# Altium schematic sheet USB.SchDoc
size A4; SheetNumber: 4; SheetTotal: 10
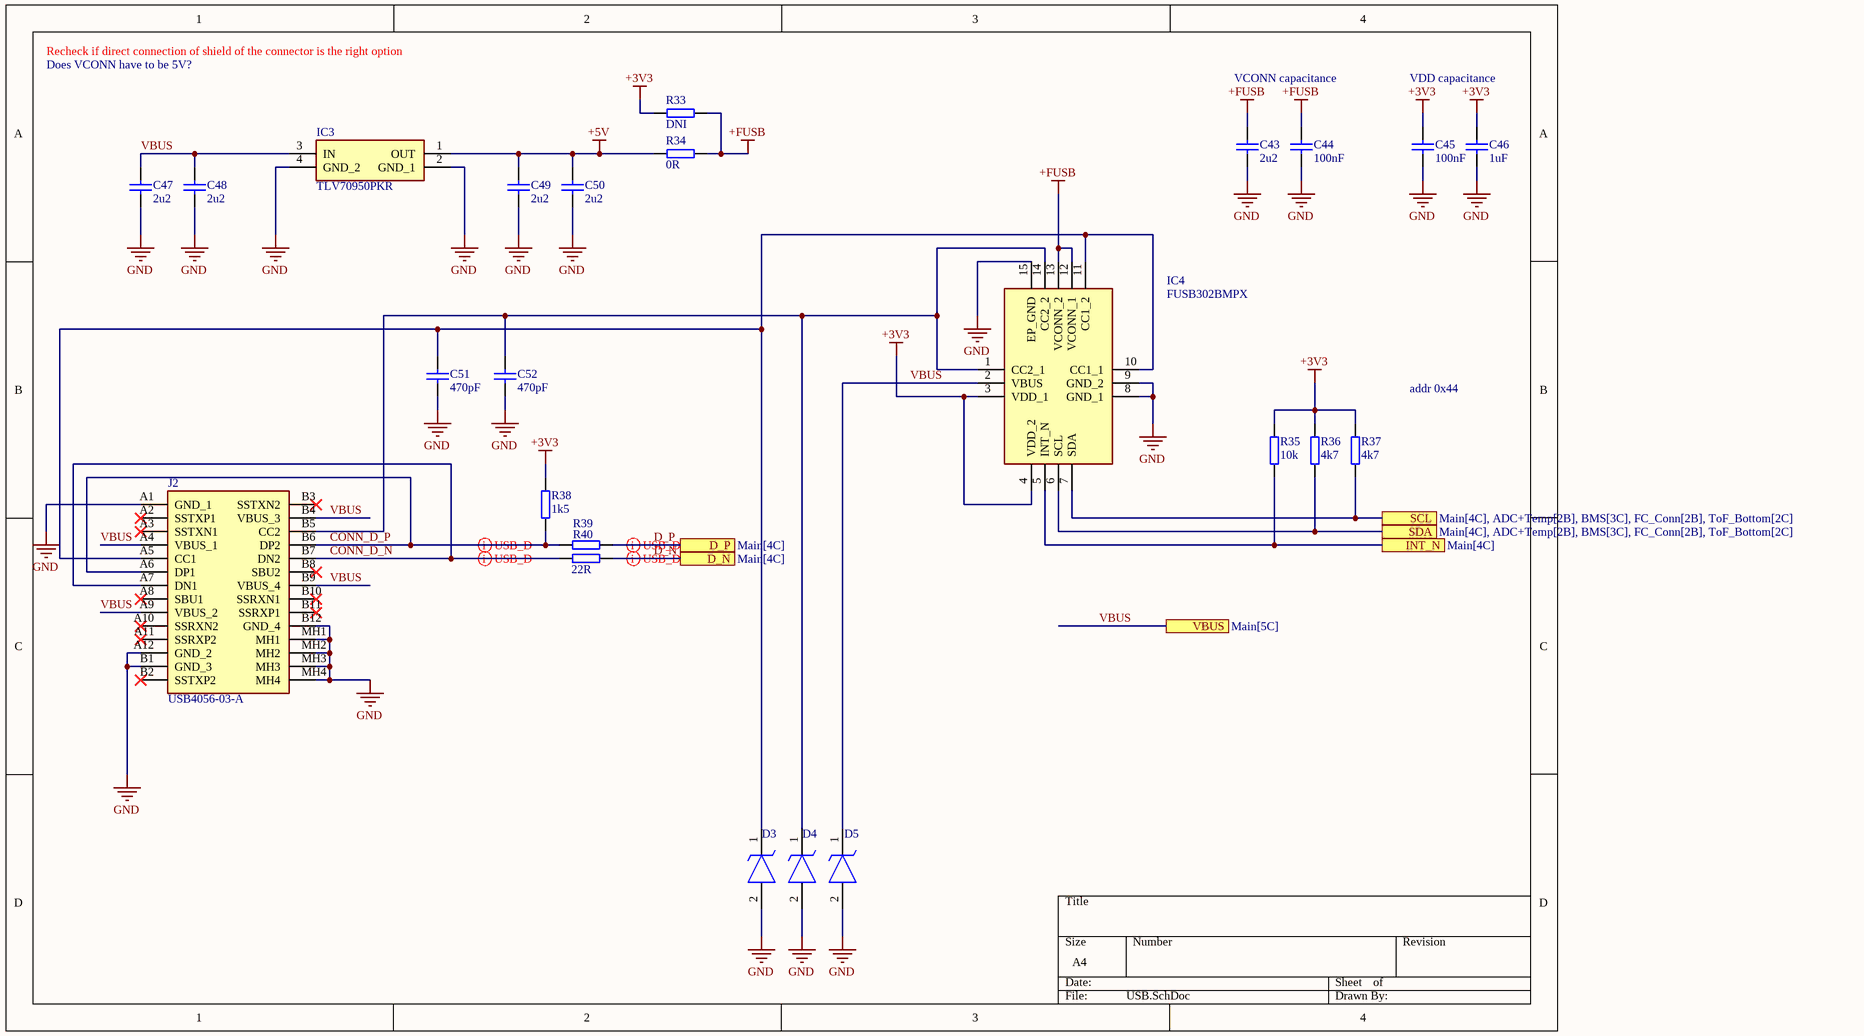
[diagram p0: USB.SchDoc]

## Parts
C43  value 2u2  [CAP0603]  (hidden comment: Cap0603)
C44  value 100nF  [CAP0402]  (hidden comment: Cap0402)
C45  value 100nF  [CAP0402]  (hidden comment: Cap0402)
C46  value 1uF  [CAP0402]  (hidden comment: Cap0402)
C47  value 2u2  [CAP0603]  (hidden comment: Cap0603)
C48  value 2u2  [CAP0603]  (hidden comment: Cap0603)
C49  value 2u2  [CAP0603]  (hidden comment: Cap0603)
C50  value 2u2  [CAP0603]  (hidden comment: Cap0603)
C51  value 470pF  [CAP0402]  (hidden comment: Cap0402)
C52  value 470pF  [CAP0402]  (hidden comment: Cap0402)
D3  D1213A-01LP4-7B  [D1213A01LP47B]  (value not drawn)
D4  D1213A-01LP4-7B  [D1213A01LP47B]  (value not drawn)
D5  DF2S24FS,L3M  [SODFL1006X45N]  (value not drawn)
IC3  TLV70950PKR  [TL431AQPKG3]
IC4  FUSB302BMPX  [QFN50P250X250X80-15N]
J2  USB4056-03-A  [USB405603A]
R33  value DNI  [RES0402]  (hidden comment: Res0402)
R34  value 0R  [RES0402]  (hidden comment: Res0402)
R35  value 10k  [RES0402]  (hidden comment: Res0402)
R36  value 4k7  [RES0402]  (hidden comment: Res0402)
R37  value 4k7  [RES0402]  (hidden comment: Res0402)
R38  value 1k5  [RES0402]  (hidden comment: Res0402)
R39  Res0402  [RES0402]  (value not drawn)
R40  value 22R  [RES0402]  (hidden comment: Res0402)

## Ports
D_N (see Main[4C]), D_P (see Main[4C]), INT_N (see Main[4C]), SCL (see Main[4C], ADC+Temp[2B], BMS[3C], FC_Conn[2B], ToF_Bottom[2C]), SDA (see Main[4C], ADC+Temp[2B], BMS[3C], FC_Conn[2B], ToF_Bottom[2C]), VBUS (see Main[5C])

## Nets
+3V3: C45.2 C46.2 IC4.3(VDD_1) IC4.4(VDD_2) R33.2 R35.2 R36.2 R37.2 R38.2
+5V: C49.2 C50.2 IC3.1(OUT) R34.2
+FUSB: C43.2 C44.2 IC4.12(VCONN_1) IC4.13(VCONN_2) R33.1 R34.1
GND: C43.1 C44.1 C45.1 C46.1 C47.1 C48.1 C49.1 C50.1 C51.1 C52.1 D3.2(A) D4.2(A) D5.2(A) IC3.2(GND_1) IC3.4(GND_2) IC4.8(GND_1) IC4.9(GND_2) IC4.15(EP_GND) J2.A1(GND_1) J2.A12(GND_2) J2.B1(GND_3) J2.B12(GND_4) J2.MH1 J2.MH2 J2.MH3 J2.MH4
CONN_D_N: J2.A7(DN1) J2.B7(DN2) R40.1
CONN_D_P: J2.A6(DP1) J2.B6(DP2) R38.1 R39.1
D_N: R40.2 ; port D_N
D_P: R39.2 ; port D_P
INT_N: IC4.5(INT_N) R35.1 ; port INT_N
SCL: IC4.7(SDA) R37.1 ; port SCL
SDA: IC4.6(SCL) R36.1 ; port SDA
VBUS: C47.2 C48.2 D5.1(K) IC3.3(IN) IC4.2(VBUS) J2.A4(VBUS_1) J2.A9(VBUS_2) J2.B4(VBUS_3) J2.B9(VBUS_4) ; port VBUS
NetC51_2: C51.2 D3.1(K) IC4.10(CC1_1) IC4.11(CC1_2) J2.A5(CC1)
NetC52_2: C52.2 D4.1(K) IC4.1(CC2_1) IC4.14(CC2_2) J2.B5(CC2)

Not connected (* = marked no-connect by the designer): J2 A2(SSTXP1)* A3(SSTXN1)* A8(SBU1)* A10(SSRXN2)* A11(SSRXP2)* B2(SSTXP2)* B3(SSTXN2)* B8(SBU2)* B10(SSRXN1)* B11(SSRXP1)*

## Layout directives
differential pair: CONN_D_N, CONN_D_P, D_N, D_P

## Notes on the sheet
- Recheck if direct connection of shield of the connector is the right option
- Does VCONN have to be 5V?
- VCONN capacitance
- VDD capacitance
- addr 0x44

## Library data of the parts
C43 C47-C50 = Cap0603: Voltage: 50V
C44-C46 = Cap0402: Voltage: 6V3
C51 C52 = Cap0402: Voltage: val
D3 D4 = D1213A-01LP4-7B: TVS Diode (Uni-directional); Manufacturer_Name: Diodes Incorporated; Datasheet Link: https://www.diodes.com/assets/Datasheets/D1213A-01LP4.pdf; Height: 0.4mm; Manufacturer_Part_Number: D1213A-01LP4-7B; Mouser Part Number: 621-D1213A-01LP4-7B; Mouser Price/Stock: https://www.mouser.co.uk/ProductDetail/Diodes-Incorporated/D1213A-01LP4-7B?qs=gfe7vQ8txpVKfG5NOSOvfA%3D%3D; Arrow Part Number: D1213A-01LP4-7B; Arrow Price/Stock: https://www.arrow.com/en/products/d1213a-01lp4-7b/diodes-incorporated?region=europe
D5 = DF2S24FS,L3M: TVS Diode (Uni-directional); Manufacturer_Name: Toshiba; Datasheet Link: https://www.mouser.com/datasheet/2/408/DF2S24FS_datasheet_en_20140718-708374.pdf; Height: 0.45mm; Manufacturer_Part_Number: DF2S24FS,L3M; Mouser Part Number: 757-DF2S24FSL3M; Mouser Price/Stock: https://www.mouser.co.uk/ProductDetail/Toshiba/DF2S24FSL3M?qs=lhkzy8lC%252BSvG2umxl0FuEw%3D%3D; Arrow Part Number: DF2S24FS,L3M; Arrow Price/Stock: https://www.arrow.com/en/products/df2s24fsl3m/toshiba?region=nac
IC3 = TLV70950PKR: Integrated Circuit; Manufacturer_Name: Texas Instruments; Datasheet Link: https://www.ti.com/lit/gpn/tlv709; Height: 1.6mm; Manufacturer_Part_Number: TLV70950PKR; Mouser Part Number: 595-TLV70950PKR; Mouser Price/Stock: https://www.mouser.co.uk/ProductDetail/Texas-Instruments/TLV70950PKR?qs=dbcCsuKDzFU3yYGsVf2izQ%3D%3D; Arrow Part Number: TLV70950PKR; Arrow Price/Stock: null?region=nac
IC4 = FUSB302BMPX: Integrated Circuit; Manufacturer_Name: onsemi; Datasheet Link: https://www.onsemi.com/pub/Collateral/FUSB302B-D.PDF; Height: 0.8mm; Manufacturer_Part_Number: FUSB302BMPX; Mouser Part Number: 512-FUSB302BMPX; Mouser Price/Stock: https://www.mouser.co.uk/ProductDetail/onsemi-Fairchild/FUSB302BMPX?qs=8ziscO3x5y1SHqdwooDK6g%3D%3D; Arrow Part Number: FUSB302BMPX; Arrow Price/Stock: https://www.arrow.com/en/products/fusb302bmpx/on-semiconductor?utm_currency=USD&region=nac
J2 = USB4056-03-A: Connector; Manufacturer_Name: GCT (GLOBAL CONNECTOR TECHNOLOGY); Datasheet Link: https://www.mouser.jp/datasheet/2/837/usb4056-2448808.pdf; Height: 3.56mm; Manufacturer_Part_Number: USB4056-03-A; Mouser Part Number: 640-USB4056-03-A; Mouser Price/Stock: https://www.mouser.co.uk/ProductDetail/GCT/USB4056-03-A?qs=QNEnbhJQKvbZ7hZzgFEugA%3D%3D
R39 = Res0402: Value: 22R